# Altium project TrailGuard1.0.PrjPcb
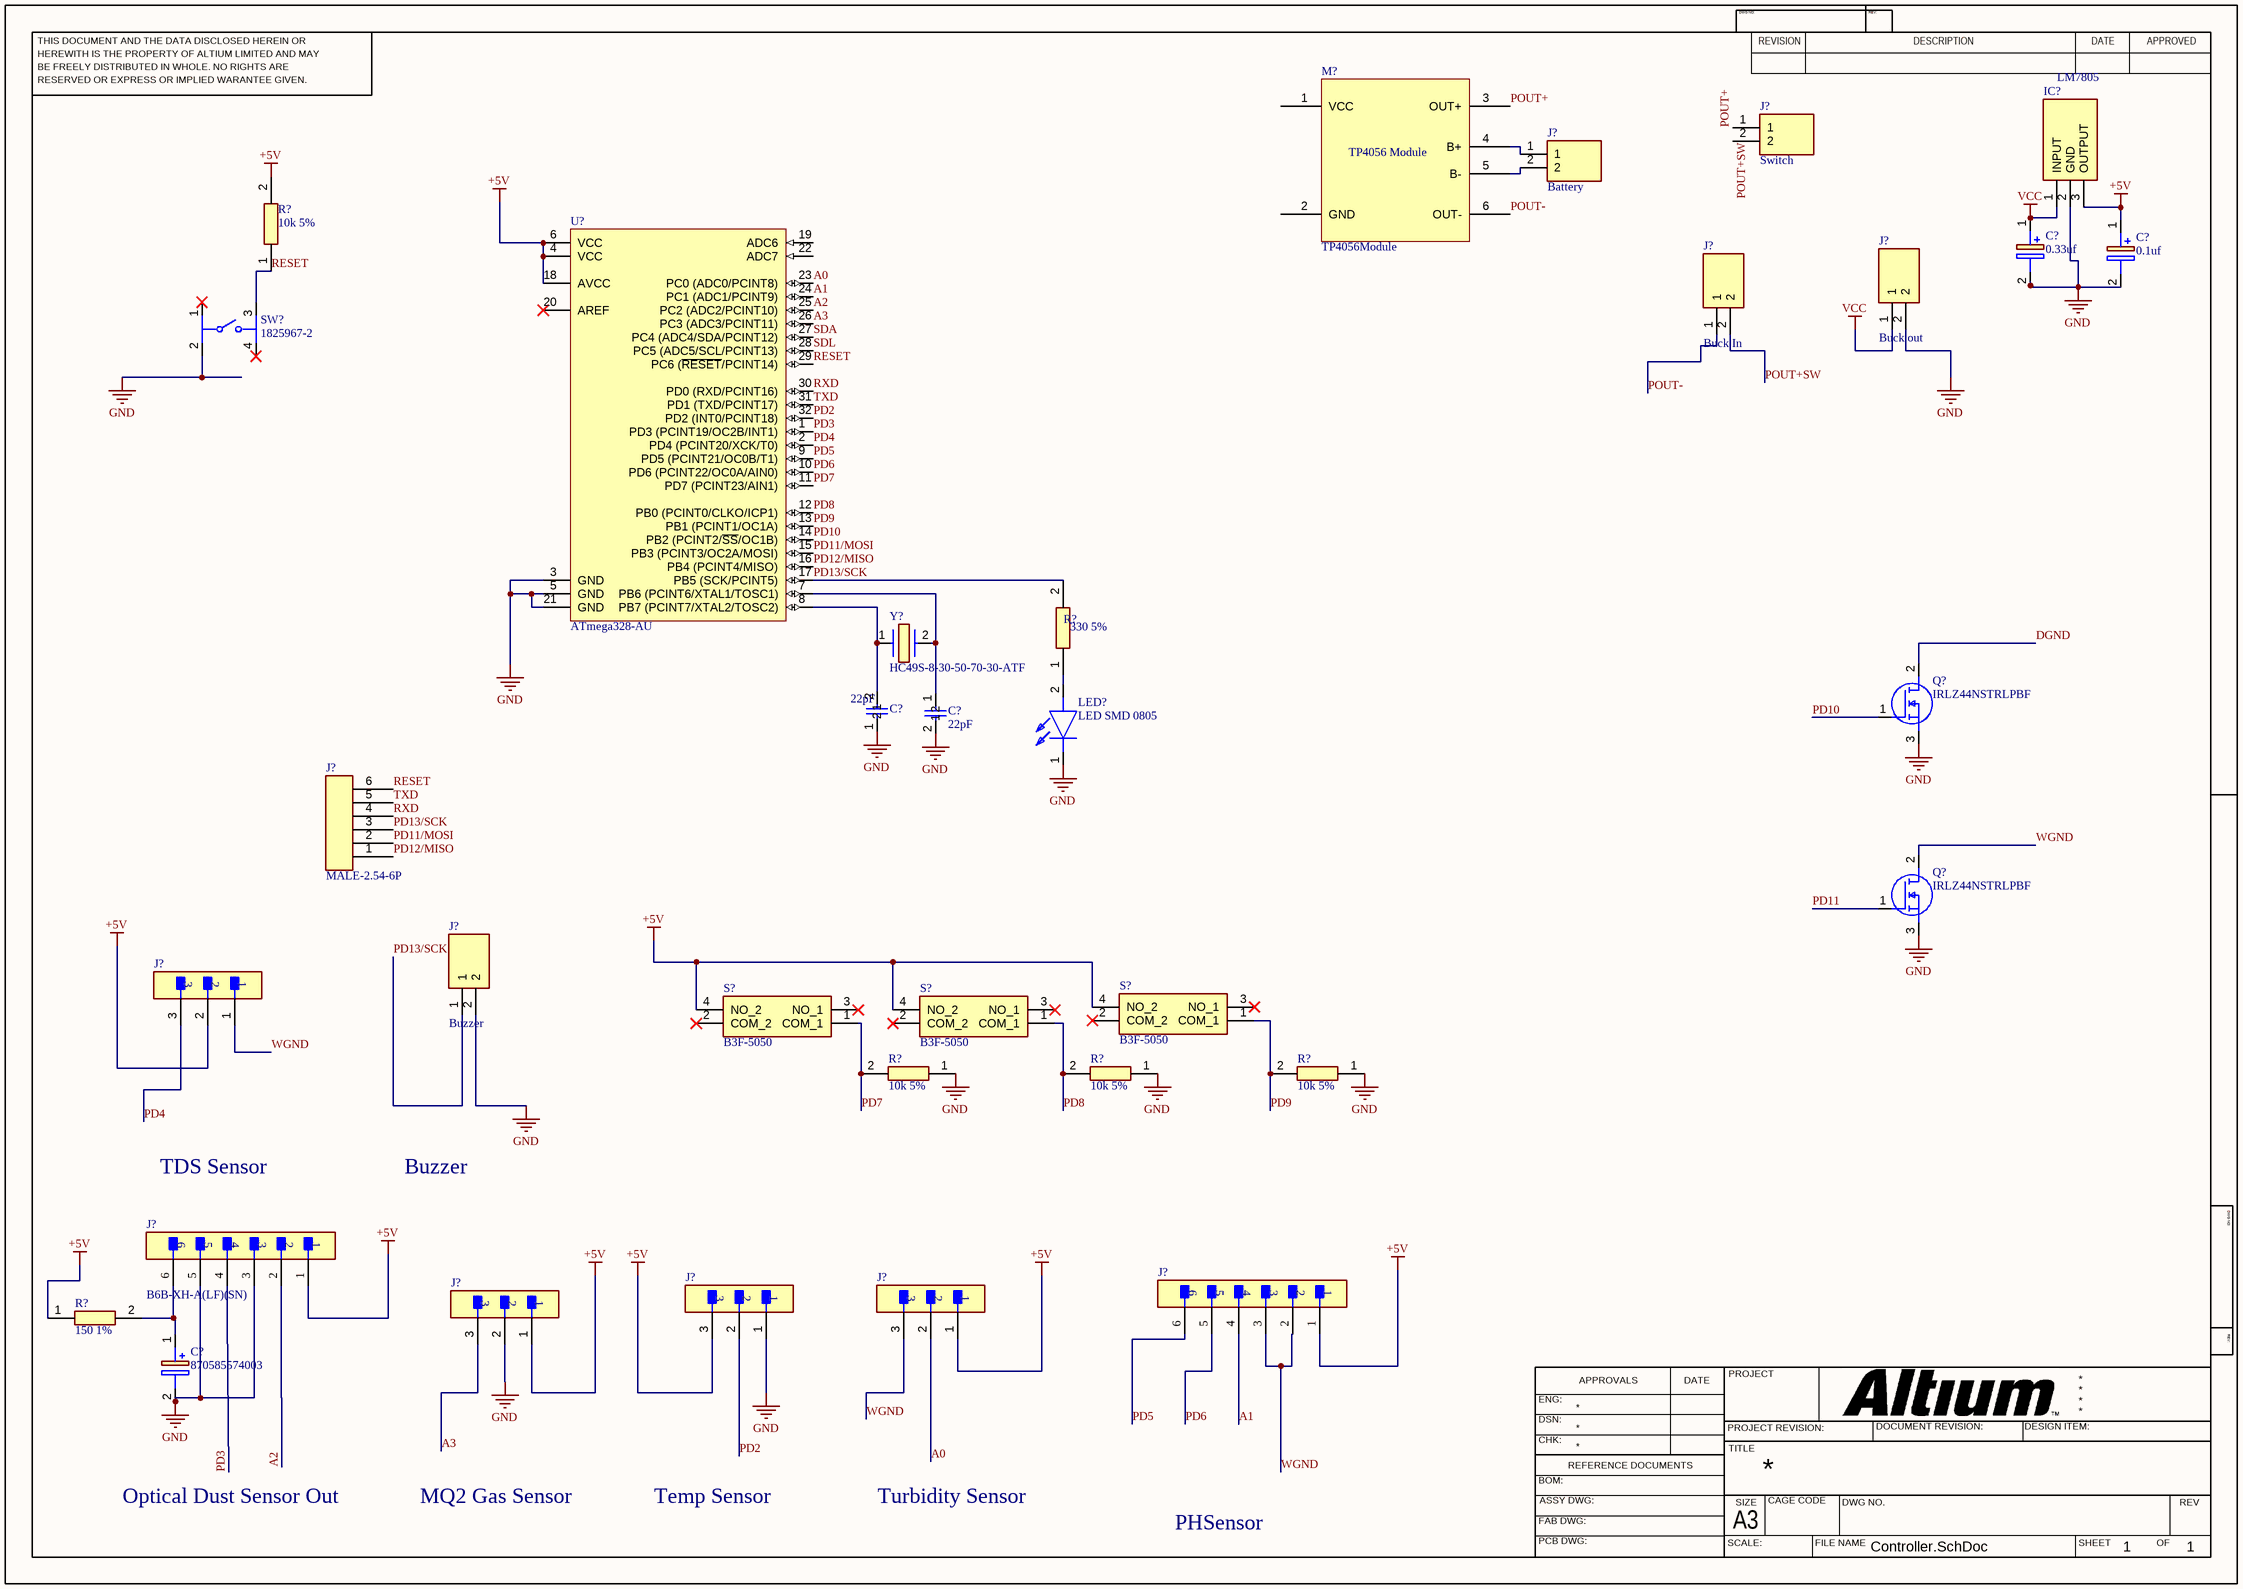
[diagram p0: Controller.SchDoc]
1 sheet, 34 parts. Net scope: global (net labels, ports and power ports of the same name join across sheets).
Board file: Controller.PcbDoc

## Sheet Controller.SchDoc
size 420 x 297 mm; SheetNumber: 1; SheetTotal: 1

### Parts
(Parts that share a designator on the sheet are numbered #1, #2 ... from top to bottom, then left to right.)
C?#1  0.33uf  [CAPPRD200W60D525H1250]
C?#2  0.1uf  [CAPPRD200W60D525H1250]
C?#3  value 22pF  [CAPC1206(3216)100_N]  (hidden comment: CAP 22pF 50V 1206(3216))
C?#4  value 22pF  [CAPC1206(3216)100_N]  (hidden comment: CAP 22pF 50V 1206(3216))
C?#5  870585574003  [CAPPRD350W65D800H1300]
IC?  LM7805  [TO254P470X1028X1955-3P]
J?#1  Switch  [B2BXHAMLFSN]
J?#2  Battery  [B2BXHAMLFSN]
J?#3  Buck out  [B2BXHAMLFSN]
J?#4  Buck In  [B2BXHAMLFSN]
J?#5  MALE-2.54-6P  [MALE-2.54-6P]
J?#6  Buzzer  [B2BXHAMLFSN]
J?#7  B3B-XH-A(LF)(SN)  [FP-B3B-XH-A_LF_SN-MFG]  (value not drawn)
J?#8  B6B-XH-A(LF)(SN)  [FP-B6B-XH-A_LF_SN-MFG]
J?#9  B6B-XH-A(LF)(SN)  [FP-B6B-XH-A_LF_SN-MFG]  (value not drawn)
J?#10  B3B-XH-A(LF)(SN)  [FP-B3B-XH-A_LF_SN-MFG]  (value not drawn)
J?#11  B3B-XH-A(LF)(SN)  [FP-B3B-XH-A_LF_SN-MFG]  (value not drawn)
J?#12  B3B-XH-A(LF)(SN)  [FP-B3B-XH-A_LF_SN-MFG]  (value not drawn)
LED?  LED SMD 0805  [LEDC2012X80N]
M?  TP4056Module  [TP4056Module]
Q?#1  IRLZ44NSTRLPBF  [IRF2804STRLPBF]
Q?#2  IRLZ44NSTRLPBF  [IRF2804STRLPBF]
R?#1  10k 5%  [RESC3116X70N]
R?#2  330 5%  [ERJP08D1000V]
R?#3  10k 5%  [RESC3116X70N]
R?#4  10k 5%  [RESC3116X70N]
R?#5  10k 5%  [RESC3116X70N]
R?#6  150 1%  [ERJ8ENF1000V]
S?#1  B3F-5050  [B3F-4055]
S?#2  B3F-5050  [B3F-4055]
S?#3  B3F-5050  [B3F-4055]
SW?  1825967-2  [FP-1825967-2-MFG]
U?  ATmega328-AU  [32A_L]
Y?  HC49S-8-30-50-70-30-ATF  [HC49S830507030ATF]

### Nets
+5V: C?#2.1 IC?.3(OUTPUT) J?#7.2 J?#8.1 J?#9.1 J?#10.3 J?#11.1 J?#12.1 R?#1.2 R?#6.1 S?#1.4(NO_2) S?#2.4(NO_2) S?#3.4(NO_2) U?.4(VCC) U?.6(VCC) U?.18(AVCC)
GND: C?#1.2 C?#2.2 C?#3.2 C?#4.1 C?#5.2(-) IC?.2(GND) J?#3.2 J?#6.2 J?#8.3 J?#8.5 J?#10.1 J?#12.2 LED?.1(K) Q?#1.3(S) Q?#2.3(S) R?#3.1 R?#4.1 R?#5.1 SW?.2 U?.3(GND) U?.5(GND) U?.21(GND)
VCC: C?#1.1 IC?.1(INPUT) J?#3.1
A0: J?#11.2 U?.23(PC0_(ADC0/PCINT8))
A1: J?#9.4 U?.24(PC1_(ADC1/PCINT9))
A2: J?#8.2 U?.25(PC2_(ADC2/PCINT10))
A3: J?#12.3 U?.26(PC3_(ADC3/PCINT11))
DGND: Q?#1.2(D)
PD2: J?#10.2 U?.32(PD2_(INT0/PCINT18))
PD3: J?#8.4 U?.1(PD3_(PCINT19/OC2B/INT1))
PD4: J?#7.3 U?.2(PD4_(PCINT20/XCK/T0))
PD5: J?#9.6 U?.9(PD5_(PCINT21/OC0B/T1))
PD6: J?#9.5 U?.10(PD6_(PCINT22/OC0A/AIN0))
PD7: R?#3.2 S?#1.1(COM_1) U?.11(PD7_(PCINT23/AIN1))
PD8: R?#4.2 S?#2.1(COM_1) U?.12(PB0_(PCINT0/CLKO/ICP1))
PD9: R?#5.2 S?#3.1(COM_1) U?.13(PB1_(PCINT1/OC1A))
PD10: Q?#1.1(G) U?.14(PB2_(PCINT2/~{SS}/OC1B))
PD11: Q?#2.1(G)
PD11/MOSI: J?#5.2 U?.15(PB3_(PCINT3/OC2A/MOSI))
PD12/MISO: J?#5.1 U?.16(PB4_(PCINT4/MISO))
PD13/SCK: J?#5.3 J?#6.1 R?#2.2 U?.17(PB5_(SCK/PCINT5))
POUT+: J?#1.1 M?.3(OUT+)
POUT+SW: J?#1.2 J?#4.2
POUT-: J?#4.1 M?.6(OUT-)
RESET: J?#5.6 R?#1.1 SW?.3 U?.29(PC6_(~{RESET}/PCINT14))
RXD: J?#5.4 U?.30(PD0_(RXD/PCINT16))
SDA: U?.27(PC4_(ADC4/SDA/PCINT12))
SDL: U?.28(PC5_(ADC5/SCL/PCINT13))
TXD: J?#5.5 U?.31(PD1_(TXD/PCINT17))
WGND: J?#7.1 J?#9.2 J?#9.3 J?#11.3 Q?#2.2(D)
NetC?#3_1: C?#3.1 U?.7(PB6_(PCINT6/XTAL1/TOSC1)) Y?.2
NetC?#4_2: C?#4.2 U?.8(PB7_(PCINT7/XTAL2/TOSC2)) Y?.1
NetC?#5_1: C?#5.1(+) J?#8.6 R?#6.2
NetJ?#2_1: J?#2.1 M?.4(B+)
NetJ?#2_2: J?#2.2 M?.5(B-)
NetLED?_2: LED?.2(A) R?#2.1

Not connected (* = marked no-connect by the designer): M? 1(VCC) 2(GND); S?#1 2(COM_2)* 3(NO_1)*; S?#2 2(COM_2)* 3(NO_1)*; S?#3 2(COM_2)* 3(NO_1)*; SW? 1* 4*; U? 19(ADC6) 20(AREF)* 22(ADC7)

### Notes on the sheet
- TDS Sensor
- Buzzer
- Optical Dust Sensor Out
- MQ2 Gas Sensor
- Temp Sensor
- Turbidity Sensor
- PHSensor
- THIS DOCUMENT AND THE DATA DISCLOSED HEREIN OR
- HEREWITH IS THE PROPERTY OF ALTIUM LIMITED AND MAY
- DWG NO:
- REVISION
- REV:
- DESCRIPTION
- DATE
- APPROVED
- BE FREELY DISTRIBUTED IN WHOLE. NO RIGHTS ARE
- RESERVED OR EXPRESS OR IMPLIED WARANTEE GIVEN.
- ENG:
- APPROVALS
- PROJECT
- DSN:
- CHK:
- REFERENCE DOCUMENTS
- PROJECT REVISION:
- TITLE
- DOCUMENT REVISION:
- DESIGN ITEM:
- BOM:
- FAB DWG:
- PCB DWG:
- ASSY DWG:
- SCALE:
- A3
- SIZE
- CAGE CODE
- FILE NAME
- DWG NO.
- SHEET
- OF
- REV
- (in symbol TP4056Module) TP4056 Module

### Library data of the parts
C?#1 C?#2 = UFG1HR33MDM1TD: Capacitor Polarised; Manufacturer_Name: Nichicon; Datasheet Link: http://nichicon-us.com/english/products/pdfs/e-ufg.pdf; Height: 12.5mm; Manufacturer_Part_Number: UFG1HR33MDM1TD; Mouser Part Number: 647-UFG1HR33MDM1TD; Mouser Price/Stock: https://www.mouser.com/Search/Refine.aspx?Keyword=647-UFG1HR33MDM1TD
C?#3 C?#4 = CMP-1037-00973-1: CAP 22pF 50V ±1% 1206 (3216 Metric) Thickness 1mm SMD; Tolerance: Â±1%; Case-Metric: 3216; Case-EIA: 1206; Technology: SMT; Rated Voltage: 50 V; Max Thickness: 1 mm
C?#5 = 870585574003: Capacitor Polarised; Manufacturer_Name: Wurth Elektronik; Datasheet Link: https://www.we-online.com/components/products/datasheet/870585574003.pdf; Height: 13mm; Manufacturer_Part_Number: 870585574003; Mouser Part Number: 710-870585574003; Mouser Price/Stock: https://www.mouser.co.uk/ProductDetail/Wurth-Elektronik/870585574003?qs=9vOqFld9vZUAYLebAKp6%2Fg%3D%3D
IC? = LM7805CT_NOPB: Integrated Circuit; Manufacturer_Name: Texas Instruments; Manufacturer_Part_Number: LM7805CT/NOPB; Datasheet Link: http://www.ti.com/lit/gpn/lm7800; Height: 4.7mm; Mouser Part Number: 926-LM7805CT/NOPB; Mouser Price/Stock: https://www.mouser.co.uk/ProductDetail/Texas-Instruments/LM7805CT-NOPB?qs=OYMYEaN9QmBS2GvaX6GSkQ%3D%3D; Arrow Part Number: LM7805CT/NOPB; Arrow Price/Stock: https://www.arrow.com/en/products/lm7805ctnopb/texas-instruments?region=europe
J?#1-J?#4 J?#6 = B2B-XH-AM_LF__SN_: Connector; Manufacturer_Name: JST (JAPAN SOLDERLESS TERMINALS); Manufacturer_Part_Number: B2B-XH-AM(LF)(SN); Datasheet Link: https://www.jst-mfg.com/product/pdf/eng/eXH.pdf; Height: 7mm; Arrow Part Number: B2B-XH-AM(LF)(SN); Arrow Price/Stock: https://www.arrow.com/en/products/b2b-xh-am-lf-sn/jst-manufacturing?region=europe
J?#5 = MALE-2.54-6P: Male Header Connector 2.54mm 6 Pins.; JLCPCB PN: C492405
J?#7 J?#10-J?#12 = CMP-17439-000014-3: CONN HEADER VERT 3POS 2.5MM; Max Voltage Rating (DC): 250V; Number of Positions: 3; Current Rating: 3A; Gender: Male; Wire/Cable Gauge: 22AWG; Contact Resistance: 20mR; Insulation Resistance: 1GR; Insulation Material: Nylon; Contact Plating: Tin; Depth: 5.75mm; Contact Type: Male Pin; Max Operating Temperature: 85°C; Insulation Color: Natural; Voltage Rating (AC): 250V; Color: Natural; Connector Type: Header; Orientation: Straight; Fastening Type: Detent; Housing Color: White; Min Operating Temperature: -25°C; Termination: Solder; Voltage Rating: 250V; Series: XH; Pitch: 2.5mm; Contact Shape: Square; Number of Rows: 1; Lead Free: Lead Free; Packaging: Bulk; Mount: Through Hole; Flammability Rating: UL94 V-0; Max Voltage Rating (AC): 250V; REACH SVHC: No SVHC; Housing Material: Polyamide; Contact Material: Brass; Lead Pitch: 2.5mm; Contact Finish - Mating: TIN; Length: 9.9mm; Max Current Rating: 3A; Number of Contacts: 3
J?#8 J?#9 = CMP-17439-000076-1: CONN HEADER VERT 6POS 2.5MM
LED? = SML-LXT0805IW-TR: LED; Manufacturer_Name: Lumex; Datasheet Link: http://uk.rs-online.com/web/p/products/8886313; Height: 0.8mm; Manufacturer_Part_Number: SML-LXT0805IW-TR; Mouser Part Number: 696-SML-LXT0805IW; Mouser Price/Stock: https://www.mouser.co.uk/ProductDetail/Lumex/SML-LXT0805IW-TR?qs=9HInCHf8eFgASaxWaq368w%3D%3D; Arrow Part Number: SML-LXT0805IW-TR; Arrow Price/Stock: https://www.arrow.com/en/products/sml-lxt0805iw-tr/lumex
M? = TP4056Module: Module for managing battery charging
Q?#1 Q?#2 = IRLZ44NSTRLPBF: MOSFET (N-Channel); Manufacturer_Name: Infineon; Datasheet Link: https://www.infineon.com/dgdl/irlz44nspbf.pdf?fileId=5546d462533600a40153567221272727; Height: 4.83mm; Manufacturer_Part_Number: IRLZ44NSTRLPBF; Mouser Part Number: 942-IRLZ44NSTRLPBF; Mouser Price/Stock: https://www.mouser.co.uk/ProductDetail/Infineon-Technologies/IRLZ44NSTRLPBF?qs=9%252BKlkBgLFf1LijFJvUznEg%3D%3D; Arrow Part Number: IRLZ44NSTRLPBF; Arrow Price/Stock: https://www.arrow.com/en/products/irlz44nstrlpbf/infineon-technologies-ag?region=nac
R?#1 R?#3-R?#5 = ERJ-8GEYJ103V: Resistor; Manufacturer_Name: Panasonic; Datasheet Link: https://4donline.ihs.com/images/VipMasterIC/IC/PANA/PANA-S-A0009891627/PANA-S-A0009891627-1.pdf?hkey=52A5661711E402568146F3353EA87419; Height: 0.7mm; Manufacturer_Part_Number: ERJ-8GEYJ103V; Mouser Part Number: 667-ERJ-8GEYJ103V; Mouser Price/Stock: https://www.mouser.co.uk/ProductDetail/Panasonic/ERJ-8GEYJ103V?qs=IZrxGxQQvkNYuW0TYiASIA%3D%3D; Arrow Part Number: ERJ-8GEYJ103V; Arrow Price/Stock: https://www.arrow.com/en/products/erj-8geyj103v/panasonic?region=nac
R?#2 = ERJP08J331V: Resistor; Manufacturer_Name: Panasonic; Datasheet Link: http://industrial.panasonic.com/cdbs/www-data/pdf/RDA0000/AOA0000C102.pdf; Height: 0.7mm; Manufacturer_Part_Number: ERJP08J331V
R?#6 = ERJ-8ENF1500V: Resistor; Manufacturer_Name: Panasonic; Datasheet Link: https://industrial.panasonic.com/cdbs/www-data/pdf/RDA0000/AOA0000C86.pdf; Height: 0.7mm; Manufacturer_Part_Number: ERJ-8ENF1500V; Mouser Part Number: 667-ERJ-8ENF1500V; Mouser Price/Stock: https://www.mouser.co.uk/ProductDetail/Panasonic/ERJ-8ENF1500V?qs=JjxTDIFmKPTW8QBP1YAtHw%3D%3D; Arrow Part Number: ERJ-8ENF1500V; Arrow Price/Stock: https://www.arrow.com/en/products/erj-8enf1500v/panasonic?region=nac
S?#1-S?#3 = B3F-5050: Switch; Manufacturer_Name: Omron Electronics; Datasheet Link: https://omronfs.omron.com/en_US/ecb/products/pdf/en-b3f.pdf; Manufacturer_Part_Number: B3F-5050; Mouser Part Number: 653-B3F-5050; Mouser Price/Stock: https://www.mouser.co.uk/ProductDetail/Omron-Electronics/B3F-5050?qs=dOLq8QE0Pqqk%2FO9x2OpTQw%3D%3D; Arrow Part Number: B3F-5050; Arrow Price/Stock: https://www.arrow.com/en/products/b3f5050/omron?region=nac
SW? = CMP-03407-000013-1: SWITCH TACTILE SPST-NO 0.05A 24V; Contact Current Rating: 50mA; Operating Force: 160gf; Switch Function: Off-Mom; Electrical Life: 500000Cycles; Illumination Type: Non-Illuminated; Actuator Material: Nylon; Switch Travel: 0.25mm; Actuator Length: 2.89mm; Throw Configuration: SPST; Contact Resistance: 100mR; Orientation: Straight; Radiation Hardening: No; Package Quantity: 750; Max Current Rating: 50mA; Contact Plating: Silver; Max Voltage Rating (DC): 24V; Type: Switch; Packaging: Loose Piece; Current Rating: 50mA; Min Operating Temperature: -35°C; Mount: Through Hole; Length: 5.99mm; Contact Material: Copper Alloy; RoHS Compliant: Yes; Termination: PC Pins; Mechanical Life: 500000Cycles; Max Operating Temperature: 105°C; Voltage Rating (DC): 24V; Series: FSMCD, Alcoswitch; Height: 7.5mm
U? = CMP-0095-00261-2: 8-bit AVR Microcontroller, 32KB Flash, 1KB EEPROM, 2KB SRAM, 32-pin TQFP, Industrial Grade (-40°C to 85°C); DatasheetVersion: revD, May-2011; ComponentLink3Description: ATmega48A/48PA/88A/88PA/168A/168PA/328/328P Summary; Code_JEDEC: MS-026-ABA; ComponentLink1URL: http://www.atmel.com/; RevisionNote: DatasheetVersion & PackageVersion updated. URLs added.; ComponentLink2Description: ATmega48A/48PA/88A/88PA/168A/168PA/328/328P Datasheet; ComponentLink1Description: Manufacturer URL; ComponentLink2URL: http://www.atmel.com/dyn/resources/prod_documents/doc8271.pdf; PackageReference: 32A; ComponentLink3URL: http://www.atmel.com/dyn/resources/prod_documents/8271S.pdf; PackageDescription: 32-Lead, 7x7x1.0 mm Body, 0.8mm Lead Pitch, Thin Profile Plastic Quad Flat Package (TQFP); PackageVersion: revC, Oct-2010
Y? = HC49S-8-30-50-70-30-ATF: Crystal or Oscillator; Manufacturer_Name: Multicomp Pro; Datasheet Link: http://www.farnell.com/datasheets/2877048.pdf; Height: 4mm; Manufacturer_Part_Number: HC49S-8-30-50-70-30-ATF